# Altium project PCB_Project.PrjPcb
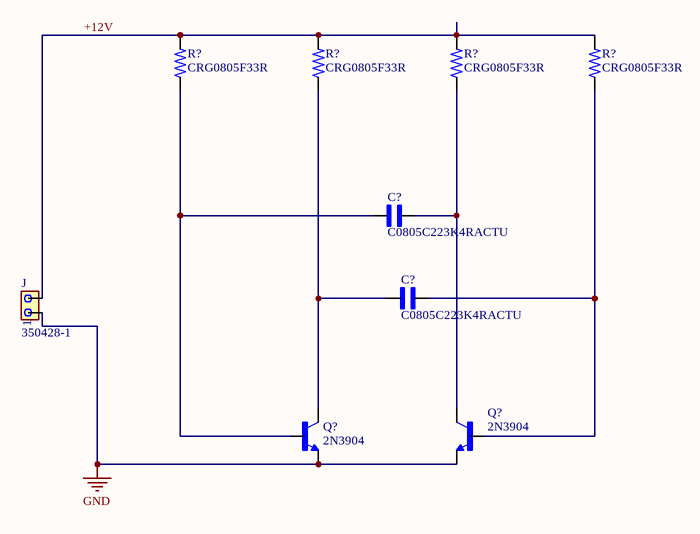
[diagram p0: Sheet1.SchDoc]
1 sheet, 9 parts. Net scope: global (net labels, ports and power ports of the same name join across sheets).
Board file: PCB1.PcbDoc

## Sheet Sheet1.SchDoc
size A4; SheetNumber: 1; SheetTotal: 1; SPICEModelCacheDERXHLLJ: <root> / <DocumentId>DERXHLLJ</DocumentId> / </root>

### Parts
(Parts that share a designator on the sheet are numbered #1, #2 ... from top to bottom, then left to right.)
C?#1  C0805C223K4RACTU  [CAPC2012X88N]
C?#2  C0805C223K4RACTU  [CAPC2012X88N]
J  350428-1  [350428-1]
Q?#1  2N3904  [TO92254P460H750-3]
Q?#2  2N3904  [TO92254P460H750-3]
R?#1  CRG0805F33R  [RESC2012X65N]
R?#2  CRG0805F33R  [RESC2012X65N]
R?#3  CRG0805F33R  [RESC2012X65N]
R?#4  CRG0805F33R  [RESC2012X65N]

### Nets
GND: J.1 Q?#1.1(E) Q?#2.1(E)
+12V: J.2 R?#1.2 R?#2.2 R?#3.2 R?#4.2
NetC?#1_1: C?#1.1 Q?#2.3(C) R?#3.1
NetC?#1_2: C?#1.2 Q?#1.2(B) R?#1.1
NetC?#2_1: C?#2.1 Q?#2.2(B) R?#4.1
NetC?#2_2: C?#2.2 Q?#1.3(C) R?#2.1

### Library data of the parts
C?#1 C?#2 = C0805C223K4RACTU: Capacitor, Ceramic, 22nF, 16VDC, 10-% Tol, 10+% Tol, X7R-TC Code, -15, 15%-TC; MF: KEMET; SnapEDA_Link: https://www.snapeda.com/parts/C0805C223K4RACTU/KEMET/view-part/?ref=snap; Package: 805-2 KEMET; Value: *; MP: C0805C223K4RACTU; Check_prices: https://www.snapeda.com/parts/C0805C223K4RACTU/KEMET/view-part/?ref=eda
J = 350428-1: Connector Power Header 2 Position 6.35mm Solder Straight Through Hole 2 Terminal 1 Port; MF: TE Connectivity; TE_purchase_URL: https://www.te.com/usa-en/product-350428-1.html?te_bu=Cor&te_type=disp&te_campaign=seda_glo_cor-seda-global-disp-prtnr-fy19-seda-model-bom-cta_sma-317_1&elqCampaignId=32493; Availability: Unavailable; Package: None; MP: 350428-1; Value: *; EU_RoHS_Compliance: Compliant; Price: None; SnapEDA_Link: https://www.snapeda.com/parts/350428-1/TE%20Connectivity%20AMP%20Connectors/view-part/494591/?ref=snap
Q?#1 Q?#2 = 2N3904: BJT, TO-92, 40V, 200mA, NPN, 0.625W, 150Â°C; MF: Diotec Semiconductor; SnapEDA_Link: https://www.snapeda.com/parts/2N3904/Diotec/view-part/?ref=snap; Package: TO-92 Diotec; Value: *; MP: 2N3904; Check_prices: https://www.snapeda.com/parts/2N3904/Diotec/view-part/?ref=eda
R?#1-R?#4 = CRG0805F33R: Fixed Resistors; MF: TE Connectivity; Price: None; MP: CRG0805F33R; Package: 0805; Value: *; Purchase-URL: https://pricing.snapeda.com/search/part/CRG0805F33R/?ref=eda; Check_prices: https://www.snapeda.com/parts/CRG0805F33R/TE+Connectivity+Passive+Product/view-part/?ref=eda; Availability: In Stock; EU_RoHS_Compliance: Compliant with Exemptions; SnapEDA_Link: https://www.snapeda.com/parts/CRG0805F33R/TE+Connectivity+Passive+Product/view-part/?ref=snap